# EAGLE design main (EAGLE 9.2.2)
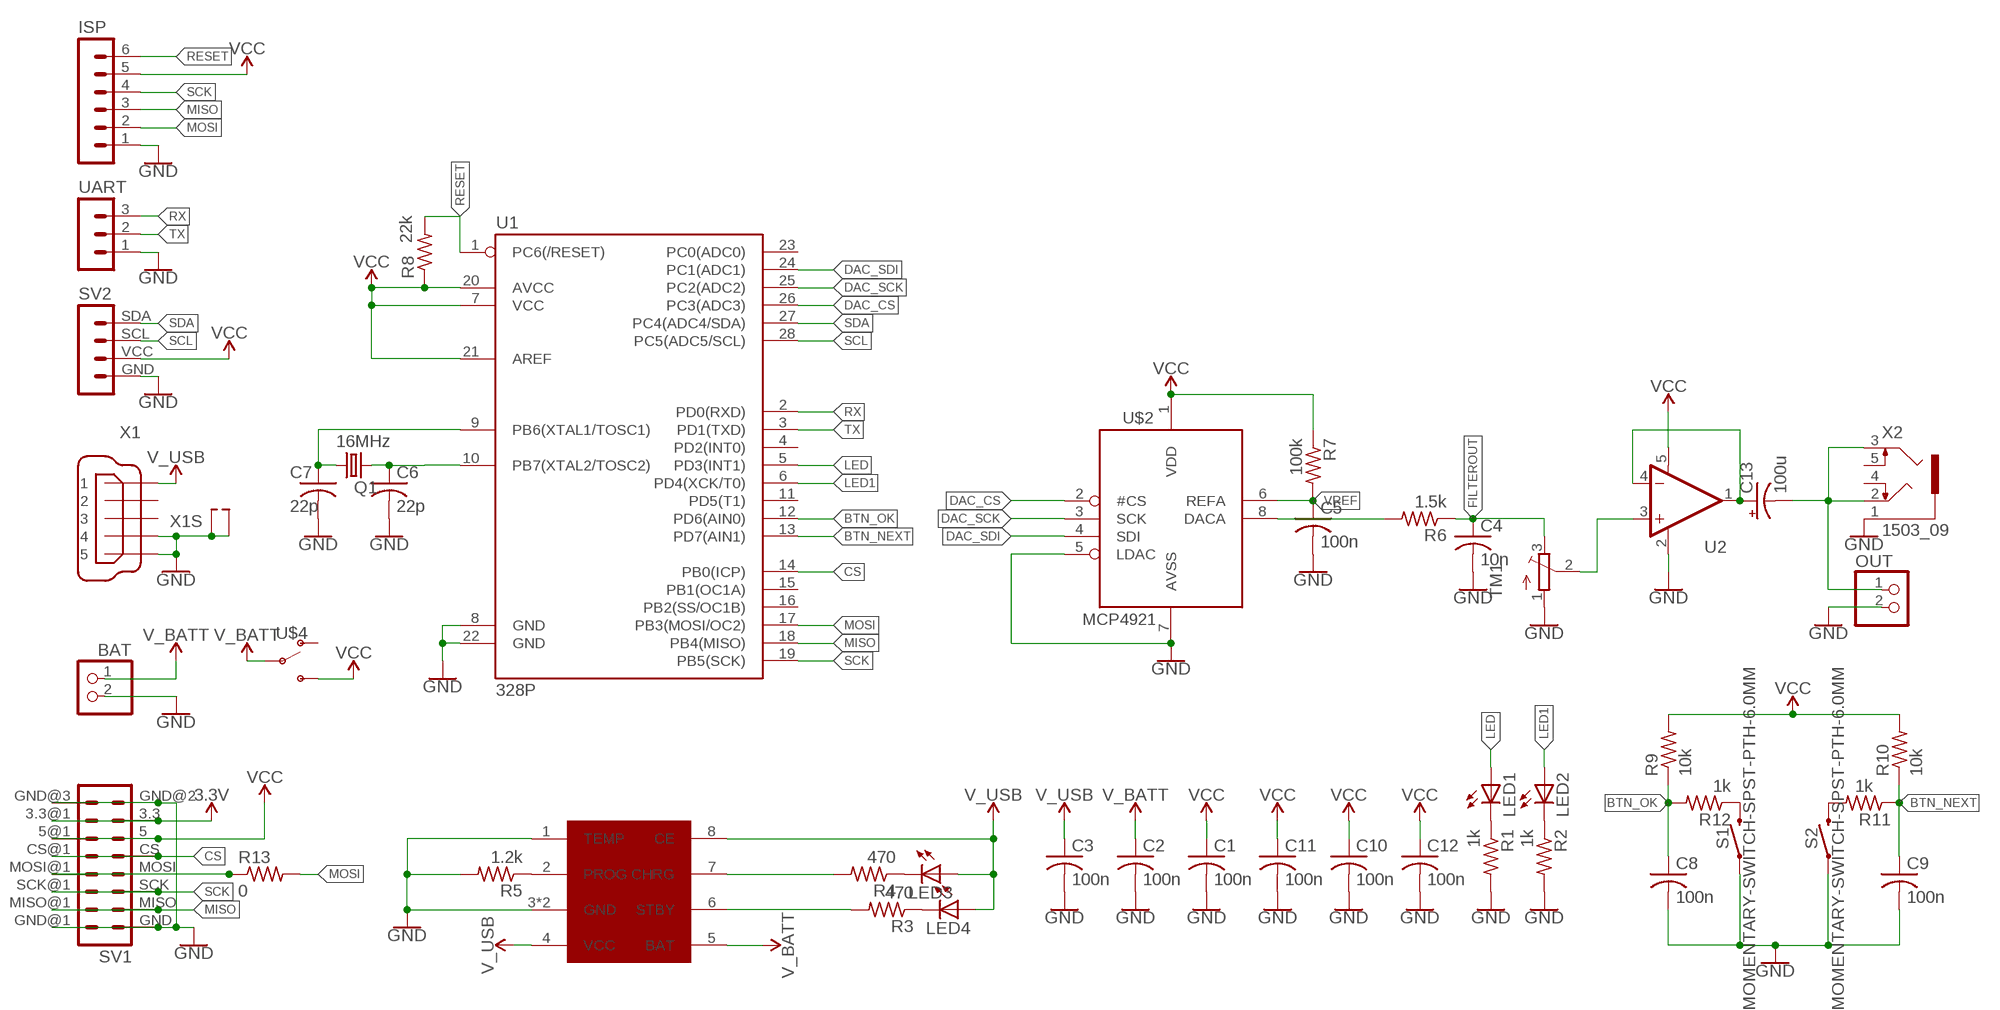
[diagram p0: schematic, sheet 1]

## Parts
BAT  PINHD-1X2  [1X02]
C1  100n  C-USC0603  [C0603]
C2  100n  C-USC0603  [C0603]
C3  100n  C-USC0603  [C0603]
C4  10n  C-USC0603  [C0603]
C5  100n  C-USC0603  [C0603]
C6  22p  C-USC0603  [C0603]
C7  22p  C-USC0603  [C0603]
C8  100n  C-USC0603  [C0603]
C9  100n  C-USC0603  [C0603]
C10  100n  C-USC0603  [C0603]
C11  100n  C-USC0603  [C0603]
C12  100n  C-USC0603  [C0603]
C13  100u  CPOL-USE2,5-6E  [E2,5-6E]
CH1  TP4056  [SOP8]
ISP  MA06-1  [MA06-1]
LED1  LED3MM  [LED3MM]
LED2  LED3MM  [LED3MM]
LED3  LED3MM  [LED3MM]
LED4  LED3MM  [LED3MM]
OUT  PINHD-1X2  [1X02]
Q1  16MHz  CRYSTALHC49S  [HC49/S]
R1  1k  R-US_R0603  [R0603]
R2  1k  R-US_R0603  [R0603]
R3  470  R-US_R0603  [R0603]
R4  470  R-US_R0603  [R0603]
R5  1.2k  R-US_R0603  [R0603]
R6  1.5k  R-US_R0603  [R0603]
R7  100k  R-US_R0603  [R0603]
R8  22k  R-US_R0603  [R0603]
R9  10k  R-US_R0603  [R0603]
R10  10k  R-US_R0603  [R0603]
R11  1k  R-US_R0603  [R0603]
R12  1k  R-US_R0603  [R0603]
R13  0  R-US_0204/5  [0204/5]
S1  MOMENTARY-SWITCH-SPST-PTH-6.0MM  [TACTILE_SWITCH_PTH_6.0MM]
S2  MOMENTARY-SWITCH-SPST-PTH-6.0MM  [TACTILE_SWITCH_PTH_6.0MM]
SV1  SD_CARD  [SD_CARD]
SV2  OLED  [OLED]
TM1  TRIMPOT3386  [TRIM-3386]
U1  328P  ATMEGA328P_PDIP  [DIP28]
U2  MCP6291T  LMC7101T-E/OT  [SOT23-5]
U$2  MCP4921  [DIL08]
U$4  PC_SPDT_SWITCH  [PC_SPDT_SWITCH]
UART  MA03-1  [MA03-1]
X1  MINI-USB_SHIELD5P2-32005-601  [32005-601]
X2  1503_09  [1503_09]

## Nets
3.3V: SV1.3.3 SV1.3.3@1(3.3)
BTN_NEXT: C9.1 R10.1 R11.1 U1.13(PD7(AIN1))
BTN_OK: C8.1 R9.1 R12.2 U1.12(PD6(AIN0))
CS: SV1.CS SV1.CS@1(CS) U1.14(PB0(ICP))
DAC_CS: U1.26(PC3(ADC3)) U$2.2(#CS)
DAC_SCK: U1.25(PC2(ADC2)) U$2.3(SCK)
DAC_SDI: U1.24(PC1(ADC1)) U$2.4(SDI)
FILTEROUT: C4.1 R6.1 TM1.3(E)
GND: BAT.2 C1.2 C2.2 C3.2 C4.2 C5.2 C6.2 C7.2 C8.2 C9.2 C10.2 C11.2 C12.2 CH1.1(TEMP) CH1.3(GND) CH1.9(GND) ISP.1 OUT.2 R1.2 R2.2 R5.2 S1.1 S2.1 SV1.GND SV1.GND@1(GND) SV1.GND@2(GND) SV1.GND@3(GND) SV2.GND TM1.1(A) U1.8(GND) U1.22(GND) U2.2(V-) U$2.5(LDAC) U$2.7(AVSS) UART.1 X1.4 X1.5 X1.M1(S1) X1.M2(S2) X2.1
LED: LED1.A U1.5(PD3(INT1))
LED1: LED2.A U1.6(PD4(XCK/T0))
MISO: ISP.3 SV1.MISO SV1.MISO@1(MISO) U1.18(PB4(MISO))
MOSI: ISP.2 R13.2 U1.17(PB3(MOSI/OC2))
N1: R13.1 SV1.MOSI SV1.MOSI@1(MOSI)
N$1: R6.2 U$2.8(DACA)
N$2: C13.+ U2.1(OUT) U2.4(-IN)
N$3: LED3.K(C) R4.1
N$4: LED4.K(C) R3.1
N$5: CH1.2(PROG) R5.1
N$6: CH1.7(CHRG) R4.2
N$7: CH1.6(STBY) R3.2
N$8: LED2.K(C) R2.1
N$9: LED1.K(C) R1.1
N$10: C13.- OUT.1 X2.2 X2.3
N$11: TM1.2(S) U2.3(+IN)
N$12: R11.2 S2.3
N$13: R12.1 S1.3
PB6(XTAL1/TOSC1): C7.1 Q1.1 U1.9(PB6(XTAL1/TOSC1))
PB7(XTAL2/TOSC2): C6.1 Q1.2 U1.10(PB7(XTAL2/TOSC2))
RESET: ISP.6 R8.2 U1.1(PC6(/RESET))
RX: U1.2(PD0(RXD)) UART.3
SCK: ISP.4 SV1.SCK SV1.SCK@1(SCK) U1.19(PB5(SCK))
SCL: SV2.SCL U1.28(PC5(ADC5/SCL))
SDA: SV2.SDA U1.27(PC4(ADC4/SDA))
TX: U1.3(PD1(TXD)) UART.2
V_BATT: BAT.1 C2.1 CH1.5(BAT) U$4.COM
V_USB: C3.1 CH1.4(VCC) CH1.8(CE) LED3.A LED4.A X1.1
VCC: C1.1 C10.1 C11.1 C12.1 ISP.5 R7.1 R8.1 R9.2 R10.2 SV1.5 SV1.5@1 SV2.VCC U1.7(VCC) U1.20(AVCC) U1.21(AREF) U2.5(V+) U$2.1(VDD) U$4.NO
VREF: C5.1 R7.2 U$2.6(REFA)
Unconnected: U1.4(PD2(INT0)) U1.11(PD5(T1)) U1.15(PB1(OC1A)) U1.16(PB2(SS/OC1B)) U1.23(PC0(ADC0)) U$4.NC X1.2 X1.3 X2.4 X2.5

## Library data of the parts
BAT OUT = pinhead:PINHD-1X2: PIN HEADER
C1-C12 = rcl:C-US: CAPACITOR, American symbol; SPICEPREFIX: C
C13 = rcl:CPOL-US: POLARIZED CAPACITOR, American symbol; SPICEPREFIX: C
CH1 = 7_segment_lib:TP4056
ISP = con-lstb:MA06-1: PIN HEADER; OC_FARNELL: unknown; OC_NEWARK: unknown
LED1-LED4 = adafruit:LED: LED OSRAM: - CHIPLED LG R971, LG N971, LY N971, LG Q971, LY Q971, LO R971, LY R971 LH N974, LH R974 LS Q976, LO Q976, LY Q976 LO Q996 - Hyper CHIPLED LW Q18S LB Q993, LB Q99A, LB R99A - SideLED LS A670, LO A670, LY A670, LG A670, LP A670 LB A673, LV A673, LT A673, LW A673 LH A674 LY A675 LS A676, LA A676, LO A676, LY A676, LW A676 LS A679, LY A679, LG A679 - Hyper Micro SIDELED® LS Y876, LA Y876, LO Y876, LY Y876 LT Y87S - SmartLED LW L88C, LW L88S LB L89C, LB L89S, LG L890 LS L89K, LO L89K, LY L89K LS L896, LA L896, LO L896, LY L896 - TOPLED LS T670, LO T670, LY T670, LG T670, LP T670 LSG T670, LSP T670, LSY T670, LOP T670, LYG T670 LG T671, LOG T671, LSG T671 LB T673, LV T673, LT T673, LW T673 LH T674 LS T676, LA T676, LO T676, LY T676, LB T676, LH T676, LSB T676, LW T676 LB T67C, LV T67C, LT T67C, LS T67K, LO T67K, LY T67K, LW E67C LS E67B, LA E67B, LO E67B, LY E67B, LB E67C, LV E67C, LT E67C LW T67C LS T679, LY T679, LG T679 LS T770, LO T770, LY T770, LG T770, LP T770 LB T773, LV T773, LT T773, LW T773 LH T774 LS E675, LA E675, LY E675, LS T675 LS T776, LA T776, LO T776, LY T776, LB T776 LHGB T686 LT T68C, LB T68C - Hyper Mini TOPLED® LB M676 - Mini TOPLED Santana® LG M470 LS M47K, LO M47K, LY M47K Source: http://www.osram.convergy.de/
Q1 = crystal:CRYSTAL: CRYSTAL; OC_FARNELL: 1667008; OC_NEWARK: unknown
R1-R13 = rcl:R-US_: RESISTOR, American symbol; SPICEPREFIX: R
S1 S2 = SparkFun-Switches:MOMENTARY-SWITCH-SPST: Momentary Switch (Pushbutton) - SPST Normally-open (NO) SPST momentary switches (buttons, pushbuttons). Variants PTH-12MM - 12mm square, through-hole Momentary Pushbutton Switch - 12mm Square <https://www.sparkfun.com/products/9190> (COM-09190) PTH-6.0MM, PTH-6.0MM-KIT - 6.0mm square, through-hole Mini Pushbutton Switch <https://www.sparkfun.com/products/97> (COM-00097) KIT package intended for soldering kit's - only one side of pads' copper is exposed. PTH-RIGHT-ANGLE-KIT - Right-angle, through-hole Right Angle Tactile Button <https://www.sparkfun.com/products/10791> - Used on SparkFun BigTime Watch Kit <https://www.sparkfun.com/products/11734> SMD-12MM - 12mm square, surface-mount Tactile Button - SMD (12mm) <https://www.sparkfun.com/products/12993> (COM-12993) Used on SparkFun PicoBoard <https://www.sparkfun.com/products/11888> SMD-4.5MM - 4.5mm Square Trackball Switch Used on SparkFun Blackberry Trackballer Breakout <https://www.sparkfun.com/products/13169> SMD-4.6MMX2.8MM - 4.60mm x 2.80mm, surface mount Used on SparkFun SAMD21 Mini Breakout <https://www.sparkfun.com/products/13664> SMD-5.2MM, SMD-5.2-REDUNDANT - 5.2mm square, surface-mount Mini Pushbutton Switch - SMD <https://www.sparkfun.com/products/8720> (COM-08720) Used on Arduino Pro Mini <https://www.sparkfun.com/products/11114> REDUNDANT package connects both switch circuits together SMD-6.0X3.5MM - 6.0 x 3.5mm, surface mount Momentary Reset Switch SMD <https://www.sparkfun.com/products/8229> (COM-08229) SMD-6.2MM-TALL - 6.2mm square, surface mount Tactile Button - SMD (6mm) <https://www.sparkfun.com/products/12992> Used on SparkFun Digital Sandbox <https://www.sparkfun.com/products/12651> SMD-RIGHT-ANGLE - Right-angle, surface mount Used on SparkFun Block for Intel® Edison - Arduino <https://www.sparkfun.com/products/13036>; PROD_ID: SWCH-08441; SF_SKU: COM-00097
SV1 = 7_segment_lib:SD_CARD: PIN HEADER; OC_FARNELL: unknown; OC_NEWARK: unknown
SV2 = 7_segment_lib:OLED; OC_FARNELL: unknown; OC_NEWARK: unknown
TM1 = adafruit:TRIMPOT: SMT trimmer potentiometer part number TC33X http://www.ladyada.net/library/eagle
U1 = SparkFun-IC-Microcontroller:ATMEGA328P_PDIP: Atmel 328P Through hole ATMEGA328P uC used in the Arduino 32kb flash, 1k EEPROM, 2k SRAM Datasheet <http://www.sparkfun.com/datasheets/Components/SMD/ATMega328.pdf> SparkFun Products Storefront component: AVR 28 Pin 20MHz 32K 6A/D - ATMega328P <https://www.sparkfun.com/products/9061> (COM-09061) SparkFun Simon Says - Through-Hole Soldering Kit <https://www.sparkfun.com/products/10547> (KIT-10547) SparkFun Learn to Solder - Simon Says <https://www.sparkfun.com/products/13708> (KIT-13708) SparkFun BigTime Watch Kit <https://www.sparkfun.com/products/11734> (KIT-11734) SparkFun ClockIt <https://www.sparkfun.com/products/10930> (KIT-10930) SparkFun Serial Enabled LCD Kit <https://www.sparkfun.com/products/10097> (LCD-10097) SparkFun Simon Tilts - Through Hole Soldering Kit <https://www.sparkfun.com/products/12634> (KIT-12634) SparkFun Frequency Counter Kit <https://www.sparkfun.com/products/10140> (KIT-10140) FabFM Radio Kit <https://www.sparkfun.com/products/11043> (KIT-11043) SparkFun Binary Blaster Kit <https://www.sparkfun.com/products/12037> (KIT-12037) SparkFun Metro-Gnome <https://www.sparkfun.com/products/9236> (KIT-09236) ATmega328 with Arduino Optiboot (Uno) <https://www.sparkfun.com/products/10524> (DEV-10524); PROD_ID: IC-09136
U2 = 7_segment_lib:LMC7101; PROD_ID: IC-11991
U$2 = adafruit:MCP4921
U$4 = 7_segment_lib:PC_SPDT_SWITCH
UART = con-lstb:MA03-1: PIN HEADER; OC_FARNELL: unknown; OC_NEWARK: unknown
X1 = con-cypressindustries:MINI-USB_SHIELD5P2-: MINI USB-B R/A DIP 5pol. Source: www.cypressindustries.com; OC_FARNELL: unknown; OC_NEWARK: unknown
X2 = con-lumberg:1503_09: Jack connectors according to JISC 6560, 3.5 mm Klinkeneinbaukupplung nach JISC 6560, 3,5 mm, 3-polig/ stereo, abgewinkelte Ausführung, mit 2 Öffnern und Lötaugen, für Leiterplatten Rückseitenmontage Source: http://www.lumberg.com/Produkte/PDFs/1503_09.pdf; OC_FARNELL: 1243244; OC_NEWARK: unknown

## Board
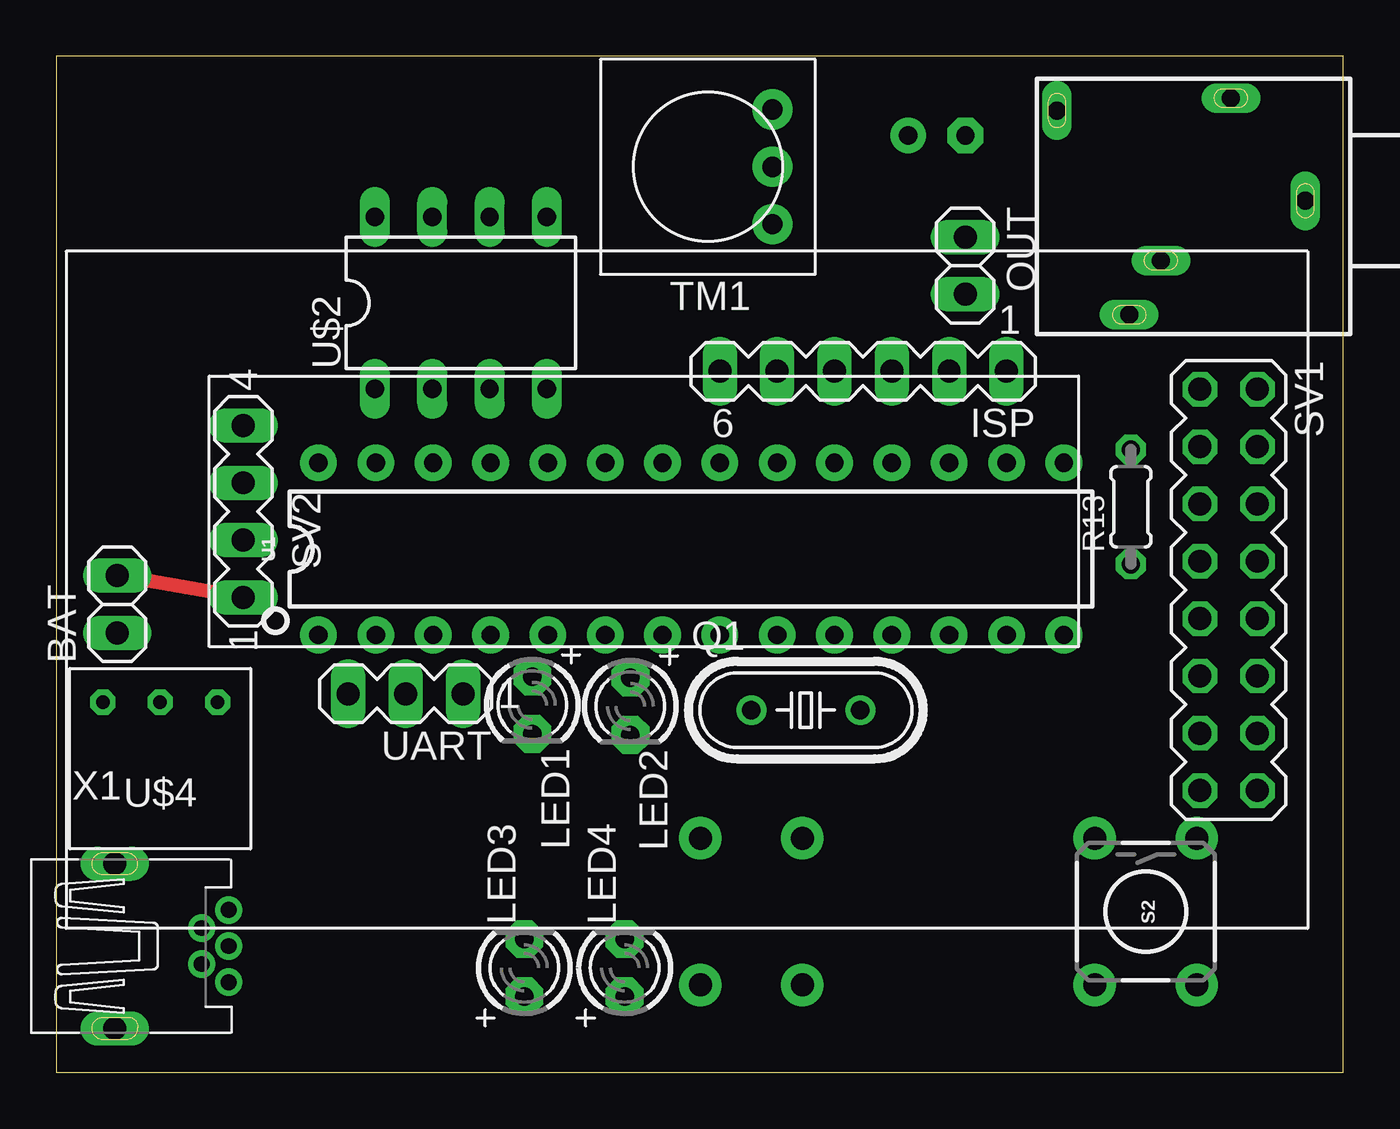
[diagram p1: board, top side]
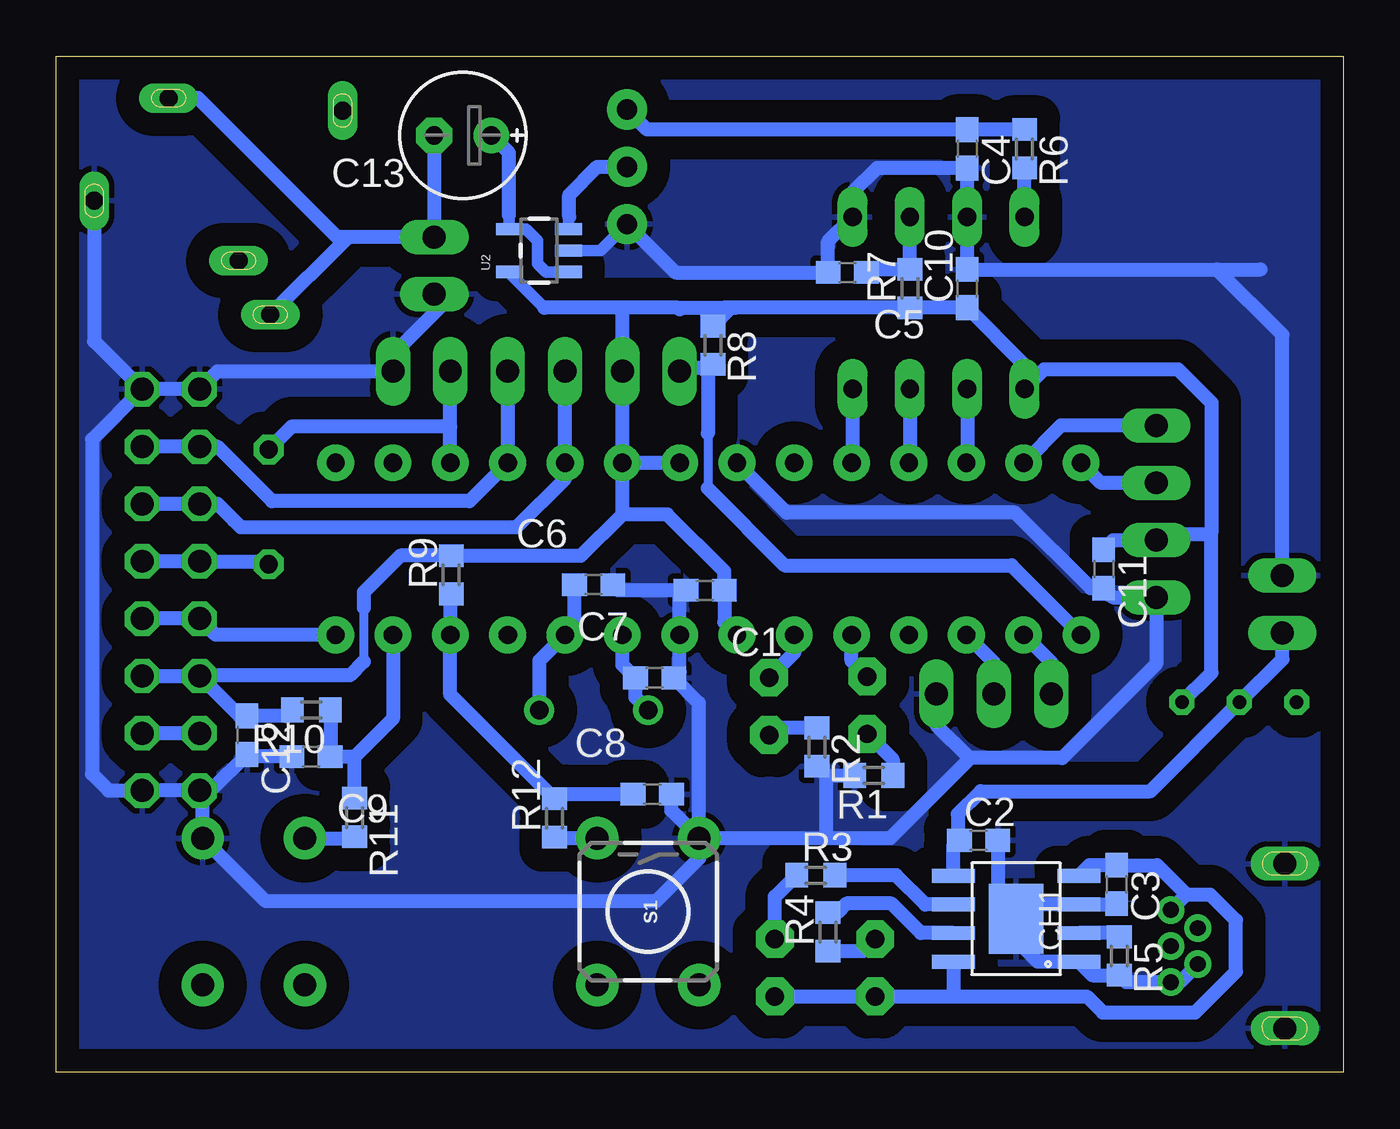
[diagram p2: board, bottom side, seen from below]

Size 57 x 45 mm. Coordinates in mm from the lower left corner, seen from the top.
Outline: 0,0 57,0 57,45 0,45 0,0
Copper layers (1*16): Top 0.035mm / dielectric 1.5mm / Bottom 0.035mm
Design rules "default": minimum track width 6mil, minimum drill 0.35mm, track to track 6mil, track to pad 6mil, pad to pad 6mil, via to via 6mil, smd to smd 6mil, copper to edge 40mil, drill to drill 6mil, minimum pad ring 10mil, minimum via ring 8mil, stop-mask expansion 4mil, vias tented up to drill 0mil, thermal gap 10mil

### Footprints (pad centres in the part's own frame; a part is rotated, then mirrored left to right if it is on the bottom)
1X02 = drill 1.016 long: 1 -1.27,0; 2 1.27,0
C0603 = smd 1.1 x 1: 1 -0.85,0; 2 0.85,0
E2,5-6E = drill 0.813 pad 1.575: + -1.27,0 | drill 0.813 pad 1.575 octagon: - 1.27,0
SOP8 = smd 0.61 x 1.91: 1 -1.905,-2.78; 2 -0.635,-2.78; 3 0.635,-2.78; 4 1.905,-2.78; 5 1.905,2.78; 6 0.635,2.78; 7 -0.635,2.78; 8 -1.905,2.78 | smd 3.1 x 2.41: 9 0,0
MA06-1 = drill 1.016 long: 1 -6.35,0; 2 -3.81,0; 3 -1.27,0; 4 1.27,0; 5 3.81,0; 6 6.35,0
LED3MM = drill 0.813 pad 1.676 octagon: A -1.27,0; K 1.27,0
HC49/S = drill 0.813: 1 -2.413,0; 2 2.413,0
R0603 = smd 1 x 1.1: 1 -0.85,0; 2 0.85,0
0204/5 = drill 0.813 octagon: 1 -2.54,0; 2 2.54,0
TACTILE_SWITCH_PTH_6.0MM = drill 1.016 pad 1.88: 1 -3.251,2.261; 2 3.251,2.261; 3 -3.251,-2.261; 4 3.251,-2.261
SD_CARD = drill 1.016 octagon: 3.3 6.35,-1.27; 3.3@1 6.35,1.27; 5 3.81,-1.27; 5@1 3.81,1.27; CS 1.27,-1.27; CS@1 1.27,1.27; GND -8.89,-1.27; GND@1 -8.89,1.27; GND@2 8.89,-1.27; GND@3 8.89,1.27; MISO -6.35,-1.27; MISO@1 -6.35,1.27; MOSI -1.27,-1.27; MOSI@1 -1.27,1.27; SCK -3.81,-1.27; SCK@1 -3.81,1.27
OLED = drill 1.016 long: GND -3.81,0; SCL 1.27,0; SDA 3.81,0; VCC -1.27,0
TRIM-3386 = drill 0.9 pad 1.778: 1 -2.54,-2.857; 2 0,-2.857; 3 2.54,-2.857
DIP28 = drill 0.813 pad 1.626: 1 -16.51,-3.81; 2 -13.97,-3.81; 3 -11.43,-3.81; 4 -8.89,-3.81; 5 -6.35,-3.81; 6 -3.81,-3.81; 7 -1.27,-3.81; 8 1.27,-3.81; 9 3.81,-3.81; 10 6.35,-3.81; 11 8.89,-3.81; 12 11.43,-3.81; 13 13.97,-3.81; 14 16.51,-3.81; 15 16.51,3.81; 16 13.97,3.81; 17 11.43,3.81; 18 8.89,3.81; 19 6.35,3.81; 20 3.81,3.81; 21 1.27,3.81; 22 -1.27,3.81; 23 -3.81,3.81; 24 -6.35,3.81; 25 -8.89,3.81; 26 -11.43,3.81; 27 -13.97,3.81; 28 -16.51,3.81
SOT23-5 = smd 0.55 x 1.2: 1 -0.95,-1.3; 2 0,-1.3; 3 0.95,-1.3; 4 0.95,1.3; 5 -0.95,1.3
DIL08 = drill 0.813 long: 1 -3.81,-3.81; 2 -1.27,-3.81; 3 1.27,-3.81; 4 3.81,-3.81; 5 3.81,3.81; 6 1.27,3.81; 7 -1.27,3.81; 8 -3.81,3.81
PC_SPDT_SWITCH = drill 0.6 octagon: COM 0,0; NC -2.54,0; NO 2.54,0
MA03-1 = drill 1.016 long: 1 -2.54,0; 2 0,0; 3 2.54,0
32005-601 = drill 0.7 pad 1.016: 1 2.825,1.6; 2 1.625,0.8; 3 2.825,0; 4 1.625,-0.8; 5 2.825,-1.6 | drill 1 pad 1.422 long: M1 -2.225,3.65; M2 -2.225,-3.65
1503_09 = drill 0.8 pad 1.2 long: 1 0,-2.1; 2 -4.55,-5.4; 3 5.05,-9.9; 4 -4,-13.1; 5 2.65,-8.5

### Placement (x,y rotation side)
BAT  2.69,20.73 90 top
C1  28.26,21.35 180 bottom
C2  16.15,10.27 0 bottom
C3  10.04,8.32 270 bottom
C4  16.65,40.91 270 bottom
C5  21.96,35.43 180 bottom
C6  33.2,21.59 0 bottom
C7  30.5,17.46 0 bottom
C8  30.61,12.31 0 bottom
C9  45.72,13.98 180 bottom
C10  16.65,34.72 90 bottom
C11  10.61,22.29 270 bottom
C12  48.56,14.93 270 bottom
C13  39,41.5 180 bottom
CH1  14.48,6.79 90 bottom
ISP  35.74,31.05 180 top
LED1  21.08,16.26 270 top
LED2  25.43,16.21 270 top
LED3  20.73,4.62 90 top
LED4  25.17,4.62 90 top
OUT  40.26,35.73 270 top
Q1  33.2,16.04 0 top
R1  20.79,13.14 180 bottom
R2  23.31,14.4 270 bottom
R3  23.36,8.72 0 bottom
R4  22.82,6.21 90 bottom
R5  9.91,5.14 270 bottom
R6  14.11,40.91 270 bottom
R7  19.19,34.72 90 bottom
R8  27.92,32.2 270 bottom
R9  39.51,22.03 90 bottom
R10  45.71,16.04 180 bottom
R11  43.78,11.28 270 bottom
R12  34.93,11.26 90 bottom
R13  47.6,25.04 90 top
S1  30.78,7.11 270 bottom
S2  48.26,7.11 270 top
SV1  51.93,21.36 270 top
SV2  8.28,24.84 90 top
TM1  28.86,40.11 90 top
U1  28.12,23.18 0 top
U2  35.62,36.4 90 bottom
U$2  17.92,34.08 0 top
U$4  4.59,16.39 0 top
UART  15.47,16.76 180 top
X1  4.81,5.58 0 top
X2  57.43,38.6 270 top

### Tracks (layer width: path | path; a pad name or v marks a point on that pad's centre or on a via)
3.3V
  Bottom 0.61: SV1.3.3 SV1.3.3@1
BTN_NEXT
  Bottom 0.61: R11.1 43.78,13.97 | 43.78,13.97 43.8,13.98 C9.1 44.86,14 R10.1 | U1.13 42.09,15.66 43.78,13.97
BTN_OK
  Bottom 0.61: R9.1 39.55,21.14 U1.12 39.55,16.73 R12.2 34.73,12.31 C8.1
CS
  Bottom 0.61: U1.14 49.94,19.37 SV1.CS SV1.CS@1
DAC_CS
  Bottom 0.61: U$2.2 16.65,27.03 U1.26
DAC_SCK
  Bottom 0.61: U$2.3 19.19,27.03 U1.25
DAC_SDI
  Bottom 0.61: U$2.4 21.73,27.03 U1.24
FILTEROUT
  Bottom 0.61: R6.1 C4.1 30.83,41.76 TM1.3
GND
  Top 0.61: SV2.GND BAT.2
  Bottom 0.508: U2.2 32.89,36.4 TM1.1
  Bottom 0.61: C6.2 32.11,21.35 C1.2 29.39,21.07 U1.8 29.39,17.73 C7.2 28.55,16.36 28.55,10.39 S1.1 | SV1.GND@1 SV1.GND 49.86,31.05 ISP.1 42.09,31.81 39.85,34.05 OUT.2 | X2.1 55.33,32.38 SV1.GND@1 | CH1.9 14.48,5.99 14.55,5.92 13.53,4.89 CH1.1 11.11,4.29 R5.2 9.6,3.98 X1.5 7.23,3.98 X1.4 | CH1.9 13.85,7.43 CH1.3 10.08,7.43 C3.2 | C2.2 15.3,7.61 CH1.9 | SV1.GND@2 SV1.GND@3 54.69,12.47 55.42,13.21 55.42,28.03 SV1.GND@1 | S1.1 29.75,11.59 C8.2 | C9.2 48.46,13.98 C12.2 50.17,12.47 SV1.GND@2 | SV1.GND@2 50.52,12.33 S2.1 47.73,7.57 30.43,7.57 28.52,9.47 S1.1 | 28.52,10.72 S1.1 | 16.51,13.92 12.45,13.92 8.28,18.09 SV2.GND 10.19,21.03 C11.2 11.18,21.44 14.53,24.79 24.65,24.79 U1.22 | 16.51,13.92 16.56,13.92 18.01,15.37 UART.1 | R2.2 22.9,13.14 | 22.9,13.14 R1.2 | 26.49,10.36 27.28,10.36 | 27.28,10.36 S1.1 | 16.51,13.92 20.07,10.36 23.01,10.36 | 23.01,10.36 27.28,10.36 | 22.9,13.14 22.9,10.47 23.01,10.36 | 5.59,35.56 C10.2 U$2.7 C4.2 20.65,40.06 21.73,38.98 U$2.5 22.81,36.81 C5.2 29.58,35.43 TM1.1 | 5.59,35.56 3.66,35.56 | BAT.2 2.69,32.67 5.59,35.56
  pour Bottom (isolate 1.016): 0,45.01 57,45.01 57,0 0,0
LED
  Bottom 0.61: LED1.A 21.77,18.21 U1.5
LED1
  Bottom 0.61: U1.6 24.31,18.59 LED2.A
MISO
  Bottom 0.61: ISP.3 37.01,27.53 U1.18 38.7,25.3 47.45,25.3 49.86,27.71 SV1.MISO SV1.MISO@1
MOSI
  Bottom 0.61: U1.17 39.55,28.6 | 39.55,28.6 ISP.2 | 39.55,28.6 46.58,28.6 R13.2
N1
  Bottom 0.61: SV1.MOSI@1 SV1.MOSI 47.73,22.63 R13.1
N$1
  Bottom 0.61: U$2.8 R6.2
N$2
  Bottom 0.508: U2.1 35.32,35.45 35.69,35.81 35.69,36.83 36.2,37.35 U2.4 36.96,37.38 36.96,37.97
  Bottom 0.61: 36.96,37.97 36.96,40.73 C13.+
N$3
  Bottom 0.61: LED3.K 21.26,5.36 R4.1
N$4
  Bottom 0.61: LED4.K 25.17,7.76 R3.1
N$5
  Bottom 0.61: R5.1 10.08,6.16 CH1.2
N$6
  Bottom 0.61: CH1.7 18.71,6.16 20.02,7.47 22,7.47 22.4,7.06 R4.2
N$7
  Bottom 0.61: CH1.6 18.5,7.43 19.8,8.72 R3.2
N$8
  Bottom 0.61: R2.1 25.11,15.25 LED2.K
N$9
  Bottom 0.61: LED1.K 19.94,13.85 R1.1
N$10
  Bottom 0.61: 43.94,37 OUT.1 40.27,37.01 C13.- | 43.94,37 44.57,37 50.72,43.15 X2.2 | X2.3 44.08,37 43.94,37
N$11
  Bottom 0.508: U2.3 34.32,37.87 34.29,37.9
  Bottom 0.61: 34.29,37.9 34.29,38.86 33.04,40.11 TM1.2
N$12
  Bottom 0.61: S2.3 43.85,10.36 R11.2
N$13
  Bottom 0.61: S1.3 34.88,10.36 R12.1
PB6(XTAL1/TOSC1)
  Bottom 0.61: Q1.1 31.35,16.6 C7.1 31.93,18.04 U1.9
PB7(XTAL2/TOSC2)
  Bottom 0.61: C6.1 34.05,19.79 U1.10 35.61,18.23 Q1.2
RESET
  Bottom 0.406: 28.14,28.3 28.14,25.86
  Bottom 0.61: R8.2 27.84,31.35 27.99,31.2 | 27.99,31.2 29.24,31.2 ISP.6 | 27.99,31.2 28.14,31.05 28.14,28.3 | 28.14,25.86 24.74,22.45 14.69,22.45 U1.1
RX
  Bottom 0.61: UART.3 12.93,18.15 U1.2
SCK
  Bottom 0.61: ISP.4 U1.19 34.47,26.29 36.63,24.13 48.82,24.13 49.15,24.46 49.86,25.17 SV1.SCK SV1.SCK@1
SCL
  Bottom 0.61: SV2.SCL 10.73,26.11 U1.28
SDA
  Bottom 0.61: SV2.SDA 12.49,28.65 U1.27
TX
  Bottom 0.61: UART.2 15.47,18.15 U1.3
V_BATT
  Bottom 0.61: CH1.5 17.26,10 | 17.26,10 C2.1 | 17.26,10 17.07,10.2 17.07,11.43 16.05,12.45 8.54,12.45 U$4.COM 2.69,18.29 BAT.1
V_USB
  Bottom 0.61: CH1.4 11.23,9.17 C3.1 8.24,9.17 6.94,7.87 | X1.1 6.94,7.87 | 6.94,7.87 5.89,7.87 4.75,6.73 4.75,4.45 6.55,2.64 10.64,2.64 11.35,3.35 17.12,3.35 | LED4.A LED3.A 17.12,3.35 | CH1.8 17.26,3.5 17.12,3.35
VCC
  Bottom 0.406: 43.38,20.57 43.38,18.19
  Bottom 0.508: 35.39,33.87 36.92,35.4 U2.5
  Bottom 0.61: U1.7 27.41,19.93 C1.1 27.41,22.18 29.94,24.71 31.93,24.71 | 27.11,33.87 26.92,33.87 R7.1 C10.1 14.11,31.32 U$2.1 13.24,31.14 7.32,31.14 5.83,29.66 5.83,23.94 | 27.11,33.87 27.16,33.87 27.45,33.87 29.46,33.87 | SV1.5 48.89,15.78 C12.1 46.82,15.78 R10.2 | SV1.5@1 SV1.5 | 31.93,24.71 U1.20 | 31.93,24.71 33.76,22.88 R9.2 41.76,22.88 43.38,21.26 43.38,20.57 | 29.46,33.87 31.95,33.87 | 31.95,33.87 35.39,33.87 | 29.39,33.79 29.46,33.87 | 43.38,18.19 43.99,17.58 50.64,17.58 SV1.5 | C11.1 10.18,23.57 SV2.VCC 8.02,23.82 5.94,23.82 5.83,23.94 | 31.95,33.87 31.93,33.84 ISP.5 U1.20 | U1.21 U1.20 | R8.1 27.11,33.87 | U$4.NO 5.83,17.69 5.83,23.94
VREF
  Bottom 0.61: U$2.6 R7.2 20.98,35.56 C5.1